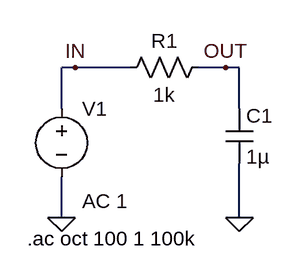
[diagram p0: schematic Draft3.asc]
Draft3.asc, the LTspice schematic file:
Version 4
SHEET 1 880 680
WIRE 112 64 96 64
WIRE 176 64 112 64
WIRE 288 64 256 64
WIRE 304 64 288 64
WIRE 96 112 96 64
WIRE 304 112 304 64
WIRE 96 240 96 192
WIRE 304 240 304 176
FLAG 96 240 0
FLAG 304 240 0
FLAG 112 64 IN
FLAG 288 64 OUT
SYMBOL voltage 96 96 R0
WINDOW 123 24 124 Left 2
WINDOW 39 0 0 Left 0
SYMATTR InstName V1
SYMATTR Value ""
SYMATTR Value2 AC 1
SYMBOL res 272 48 R90
WINDOW 0 0 56 VBottom 2
WINDOW 3 32 56 VTop 2
SYMATTR InstName R1
SYMATTR Value 1k
SYMBOL cap 288 112 R0
SYMATTR InstName C1
SYMATTR Value 1µ
TEXT 56 264 Left 2 !.ac oct 100 1 100k

The netlist it stands for:
* Draft3.asc
V1 IN 0 AC 1
R1 OUT IN 1k
C1 OUT 0 1µ
.ac oct 100 1 100k
.backanno
.end

* Results of the author's LTspice run, read from the files saved beside the schematic
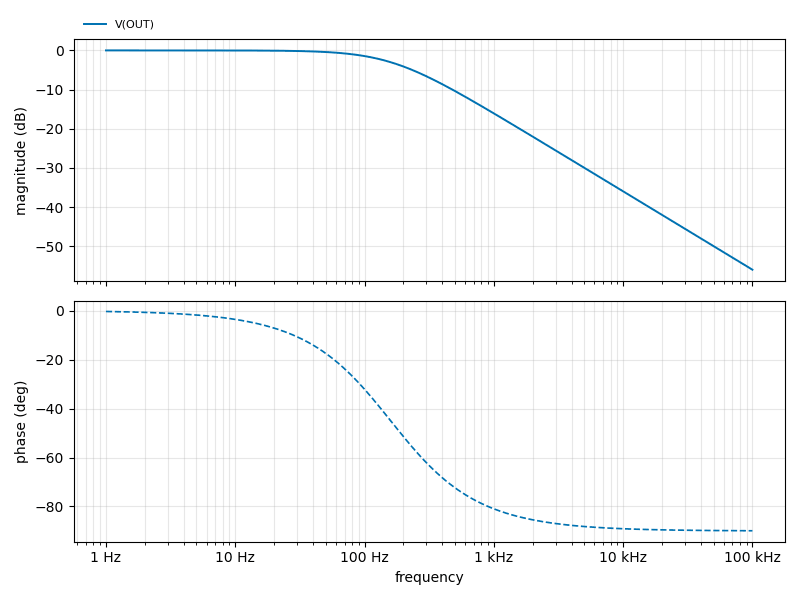
[diagram p1: AC Analysis of Draft3.asc, plotted from the saved traces]
* AC Analysis, 1 run:
*   V(OUT): -0.00 dB at 1 Hz, -55.96 dB at 100 kHz, peak -0.00 dB at 1 Hz, 3 dB below the peak at 159.2 Hz